# Altium project AudioUFO.PrjPcb
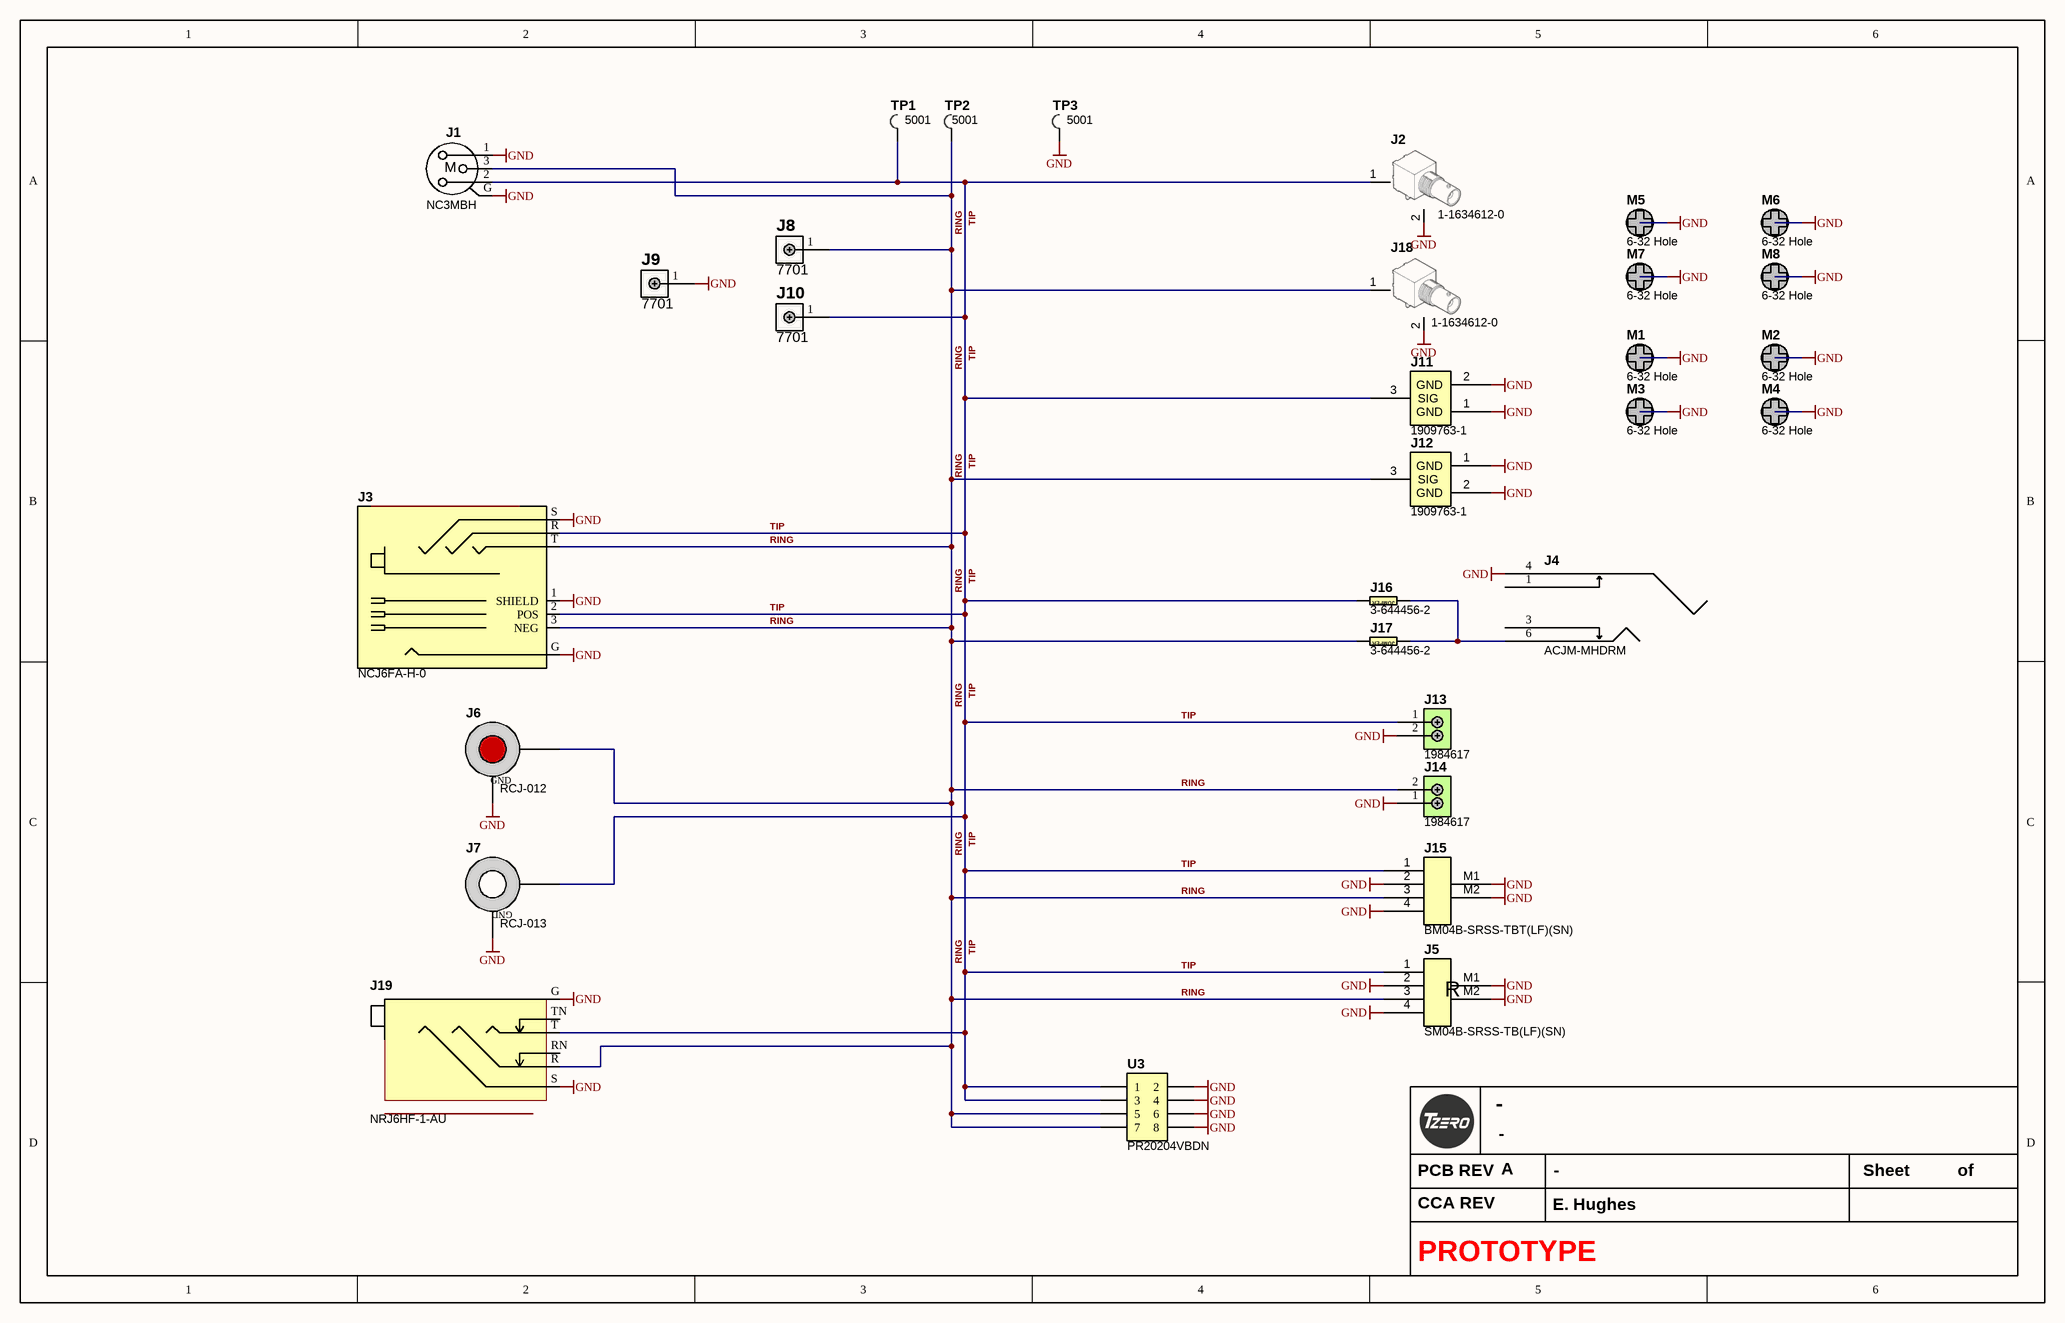
[diagram p0: AudioUFO.SchDoc]
PROJECT_TITLE_LINE_2: -; PROJECT_TITLE_LINE_1: -; PROJECT_STATUS: PROTOTYPE; PROJECT_SHORT_TITLE: AUDIO_UFO; PROJECT_ENGINEER: E. Hughes; PROJECT_BASE_PART_NUMBER: -; PCB_VERSION: A; PCB_SOLDER_MASK_COLOR_TOP: GREEN; PCB_SOLDER_MASK_COLOR_BOTTOM: GREEN; PCB_SILKSCREEN_COLOR_TOP: WHITE; PCB_SILKSCREEN_COLOR_BOTTOM: WHITE; PCB_PRINTOUT_SCALE: 1:1; PCB_PART_NUMBER: AUDIO_UFO; PCB_MIN_TRACE_WIDTH: 6mil; PCB_MIN_TRACE_SPACE: 6mil; PCB_MIN_DRILL: 12mil; PCB_MATERIAL: FR4; PCB_LAYERS: 2; PCB_FINISH_PLATING: LEAD FREE HASL; PCB_FINISHED_THICKNESS: 62.5mil; PCB_DRC_DATE: X; PCB_DIMENSION_Y: X; PCB_DIMENSION_X: X; PCB_COPPER_WEIGHT_OUTER: 1 oz; PCB_COPPER_WEIGHT_INNER: 1oz; BOM_NOTES_LINE_4: -; BOM_NOTES_LINE_3: -; BOM_NOTES_LINE_2: -; BOM_NOTES_LINE_1: -; APPROVAL_REVIEWED_DATE: -; APPROVAL_REVIEWED: -; APPROVAL_ENGINEER_DATE: -; APPROVAL_ENGINEER: -; APPROVAL_DRAWN_DATE: -; APPROVAL_DRAWN: -; APPROVAL_CHECKED_DATE: -; APPROVAL_APPROVED_2_DATE: -; APPROVAL_APPROVED_2: -; APPROVAL_APPROVED_1_DATE: -; APPROVAL_APPROVED_1: -
1 sheet, 31 parts. Net scope: global (net labels, ports and power ports of the same name join across sheets).
Board file: AudioUFO.PcbDoc

## Sheet AudioUFO.SchDoc
size B; Organization: Altium Limited; Address1: 3 Minna Close; Address2: Belrose; Address3: NSW 2085; Address4: Australia; PAGE_TITLE: -

### Parts
J1  NC3MBH  [NC3MBH]
J2  1-1634612-0  [1-1634612-0]
J3  NCJ6FA-H-0  [NEUTRIK_NCJ6FA-H-0]
J4  ACJM-MHDRM  [ACJS-MHDR]
J5  SM04B-SRSS-TB(LF)(SN)  [SM04B-SRSS-TB(LF)(SN)]
J6  RCJ-012  [RCJ-014]
J7  RCJ-013  [RCJ-014]
J8  7701  [7701]
J9  7701  [7701]
J10  7701  [7701]
J11  1909763-1  [1909763-1]
J12  1909763-1  [1909763-1]
J13  1984617  [1984617]
J14  1984617  [1984617]
J15  BM04B-SRSS-TBT(LF)(SN)  [BM04B-SRSS-TBT(LF)(SN)]
J16  3-644456-2  [3-644456-2]
J17  3-644456-2  [3-644456-2]
J18  1-1634612-0  [1-1634612-0]
J19  NRJ6HF-1-AU  [NEUTRIK_NRJ6HF-1]
M1  6-32 Hole  [6-32 X 0]
M2  6-32 Hole  [6-32 X 0]
M3  6-32 Hole  [6-32 X 0]
M4  6-32 Hole  [6-32 X 0]
M5  6-32 Hole  [6-32 X 0]
M6  6-32 Hole  [6-32 X 0]
M7  6-32 Hole  [6-32 X 0]
M8  6-32 Hole  [6-32 X 0]
TP1  5001  [5001]
TP2  5001  [5001]
TP3  5001  [5001]
U3  PR20204VBDN  [HEADER 2x4 .100"]

### Nets
GND: J1.1 J1.G J2.2 J3.1(SHIELD) J3.G J3.S J4.4 J5.2 J5.4 J5.M1 J5.M2 J6.1 J7.1 J9.1 J11.1(GND) J11.2(GND) J12.1(GND) J12.2(GND) J13.2 J14.1 J15.2 J15.4 J15.M1 J15.M2 J18.2 J19.G J19.S M1.1 M2.1 M3.1 M4.1 M5.1 M6.1 M7.1 M8.1 TP3.1 U3.2 U3.4 U3.6 U3.8
RING: J1.3 J3.3(NEG) J3.T J5.3 J6.2(Signal) J8.1 J12.3(SIG) J14.2 J15.3 J17.2 J18.1 J19.R TP2.1 U3.5 U3.7
TIP: J1.2 J2.1 J3.2(POS) J3.R J5.1 J7.2(Signal) J10.1 J11.3(SIG) J13.1 J15.1 J16.2 J19.T TP1.1 U3.1 U3.3
NetJ4_6: J4.6 J16.1 J17.1

Not connected (* = marked no-connect by the designer): J4 1 3; J19 RN TN

### Notes on the sheet
- PCB REV
- Sheet
- of
- CCA REV
- (in symbol 3-644456-2) JUMPER
- (in symbol NC3MBH) M
- (in symbol RCJ-012) GND
- (in symbol RCJ-013) GND
- (in symbol SM04B-SRSS-TB(LF)(SN)) R

### Library data of the parts
J1 = NC3MBH: XLR 3-Pin Male Right Angle; Manufacturer Part Number: NC3MBH-1; MF: NEUTRIK; >NAME: X2; MPN: NC3MBH; OC_FARNELL: unknown; OC_NEWARK: 91F3470; Supplier 1: Newark; Manufacturer: NEUTRIK; Stock 1: 0; Pricing 1: 100=3.06, 300=2.8, 500=2.6, 1000=2.45 (USD); Supplier Part Number 1: 10X8735; Value: NC3MBH
J2 J18 = 1-1634612-0: TE CONNECTIVITY / GREENPAR         1-1634612-0            RF / Coaxial Connector, BNC Coaxial, Right Angle Jack, Solder, 50 ohm, Brass; Plating: Nickel; Dielectric Material: Polyethylene; Frequency: 4GHz; Gender: Female; Polarity: Normal; Insulation Resistance: 5GR; Value: 1-1634612-0; Supplier 1: Digi-Key; Supplier Part Number 1: A97555-ND; Manufacturer: TE Connectivity; Manufacturer Part Number: 1-1634612-0; Stock 1: 5894; Pricing 1: 1=1.62, 10=1.47, 25=1.38, 50=1.32, 100=1.26, 250=1.14, 500=1.05, 1000=0.9 (USD); Mount: Panel; Contact Material: Brass; Contact Plating: Gold; Colour: Black; Body Plating: Nickel; Insulation Material: Polyethylene; Housing Material: Polyester; Min Operating Temperature: -55°C; Max Operating Temperature: 85°C; Termination: Solder; Orientation: Right Angle; Package Quantity: 100; Fastening Type: Bayonet; Max Frequency: 4GHz; Wire/Cable Type: Coaxial; Length: 34.9mm; Depth: 14.7mm; Radiation Hardening: No; REACH SVHC: Unknown; ELV: Compliant; ComponentLink1URL: https://datasheet.ciiva.com/1116/1663556-1116594.pdf; ComponentLink1Description: https://datasheet.ciiva.com/1116/1663556-1116594.pdf; ComponentLink2URL: https://datasheet.ciiva.com/1115/1729824-1115699.pdf; ComponentLink2Description: https://datasheet.ciiva.com/1115/1729824-1115699.pdf; ComponentLink3URL: https://datasheet.ciiva.com/642/eng-cd-1634612-e-642773.pdf; ComponentLink3Description: https://datasheet.ciiva.com/642/eng-cd-1634612-e-642773.pdf; ComponentLink4URL: https://datasheet.ciiva.com/30076/eng-ds-6-1773448-5-zdc-rf-coax-50-75-ohm-1007-30076757.pdf; ComponentLink4Description: https://datasheet.ciiva.com/30076/eng-ds-6-1773448-5-zdc-rf-coax-50-75-ohm-1007-30076757.pdf; ComponentLink5URL: https://datasheet.ciiva.com/16547/eng-ds-6-1773448-5-zdc-rf-coax-50-75-ohm-1007-16547606.pdf; ComponentLink5Description: https://datasheet.ciiva.com/16547/eng-ds-6-1773448-5-zdc-rf-coax-50-75-ohm-1007-16547606.pdf; ComponentLink6URL: https://datasheet.ciiva.com/3133/eng-ds-6-1773448-5-zdc-rf-coax-50-75-ohm-1007-3133498.pdf; ComponentLink6Description: https://datasheet.ciiva.com/3133/eng-ds-6-1773448-5-zdc-rf-coax-50-75-ohm-1007-3133498.pdf; ComponentLink7URL: https://datasheet.ciiva.com/11762/0900766b806d6b45-11762972.pdf; ComponentLink7Description: https://datasheet.ciiva.com/11762/0900766b806d6b45-11762972.pdf
J3 = NCJ6FA-H-0: XLR Connectors A SERIES COMBO;3POLE FEM;NOLATCH;RET SPRG; Manufacturer: Neutrik; CategorySort: 800; Current Rating: 3 A; Gender: Female; Voltage: 50 V; Number of Positions / Contacts: 3; Value: NCJ6FA-H-0; Sort Value: *; Category: Connectors; Supplier 1: Mouser; Supplier Part Number 1: 568-NCJ6FA-H-0; Manufacturer Part Number: NCJ6FA-H-0; RoHS: RoHS Compliant; Stock 1: 0; Pricing 1: 1=2.18, 10=2.11, 25=1.98, 50=1.93, 100=1.80, 200=1.76, 500=1.68, 1000=1.62, 2000=1.51 (USD); Contact Plating: Gold; Orientation: Horizontal; Termination Style: Solder; Contact Material: Bronze; Mounting Style: PCB; Product Category: XLR Panel Mount Connectors; Product Type: Connectors; Standard: Standard XLR; Standard Pack Qty: 10; RoHS - Mouser: Y; Minimum Order Quantity: 1; Reeling: False; ComponentLink1URL: http://www.neutrik.us/en-us/plugs-jacks/jacks/combo-a-series/ncj6fa-h-0; ComponentLink1Description: http://www.neutrik.us/en-us/plugs-jacks/jacks/combo-a-series/ncj6fa-h-0
J4 = ACJM-MHDRM: Phone Connectors 1/4"HOR Snap-fit CHASSIS CONN; Manufacturer: Amphenol Audio; Gender: Female; Number of Positions / Contacts: 1; Switch Configuration: Switched; Supplier 1: Mouser; Manufacturer Part Number: ACJM-MHDRM; Category: Phone Connectors; Stock 1: 9; Pricing 1: 1=1.77, 10=1.66, 50=1.53, 100=1.33 (AUD); Color: Black; Orientation: Horizontal; Series: M Series; Termination Style: Solder; Mounting Style: PCB; Standard: 1/4 in; Minimum Order Quantity: 1; Reeling: False; ComponentLink1URL: http://www.amphenolaudio.com/catalogue/Amphenol_Phone_Plugs_Jacks.pdf; ComponentLink1Description: http://www.amphenolaudio.com/catalogue/Amphenol_Phone_Plugs_Jacks.pdf; Supplier Part Number 1: 523-ACJM-MHDRM; Value: ACJM-MHDRM
J5 = SM04B-SRSS-TB(LF)(SN): Conn Shrouded Header HDR 4 POS 1mm Solder RA SMD T/R; Manufacturer: JST; Number of Positions: 4; Connector Type: Male Pin; Contact Resistance: 40mR; Max Current Rating: 1A; Max Voltage Rating (AC): 50V; Pitch: 0.039inch; Value: SM04B-SRSS-TB(LF)(SN); Supplier 1: Digi-Key; Manufacturer Part Number: SM04B-SRSS-TB(LF)(SN); Stock 1: 43886; Pricing 1: 1=0.61, 10=0.569, 100=0.436, 500=0.37914, 1000=0.31279 (USD); Mount: Surface Mount; Contact Material: Copper Alloy; Contact Plating: Copper,Tin; Colour: Natural; Housing Colour: Beige; Housing Material: Polyamide; Min Operating Temperature: -25°C; Max Operating Temperature: 85°C; Number of Rows: 1; Termination: Solder; Packaging: Tape and Reel; Orientation: Right Angle; Number of Contacts: 4; Max Voltage Rating (DC): 50V; Length: 6mm; Depth: 4.95mm; Lead Free: Lead Free; ComponentLink1URL: https://datasheet.ciiva.com/26894/getdatasheetpartid-499363-26894945.pdf; ComponentLink1Description: https://datasheet.ciiva.com/26894/getdatasheetpartid-499363-26894945.pdf; ComponentLink2URL: https://datasheet.ciiva.com/26894/getdatasheetpartid-640736-26894676.pdf; ComponentLink2Description: https://datasheet.ciiva.com/26894/getdatasheetpartid-640736-26894676.pdf; ComponentLink3URL: https://datasheet.ciiva.com/16487/jstsm04b-srss-tb-lf-sn-16487222.pdf; ComponentLink3Description: https://datasheet.ciiva.com/16487/jstsm04b-srss-tb-lf-sn-16487222.pdf; Supplier Part Number 1: 455-1804-1-ND
J6 = RCJ-012: CONN RCA JACK METAL R/A YEL PCB; Manufacturer: CUI Inc; Connector Type: Phono (RCA) Jack; Gender: Female; Signal Lines: Mono; Plug/Mating Plug Diameter: 3.20mm ID, 9.00mm OD (RCA); Number of Positions/Contacts: 2 Conductors, 2 Contacts; Internal Switch(s): Does Not Contain Switch; Shielding: Unshielded; Color - Contact: Red; Manufacturer Part Number: RCJ-012; RoHS: RoHS Compliant; Category: Connectors, Interconnects; Stock 1: 17644; Pricing 1: 1=0.96, 10=0.746, 100=0.5693, 500=0.4554, 1000=0.4048, 2500=0.33649 (USD); Mounting Type: Through Hole, Right Angle; Termination: Solder; Features: Board Lock; Contact Material: Brass; Contact Material - Plating: Tin; Housing Material: Steel; Housing Color: Silver; Operating Temperature: -20°C ~ 85°C; Voltage - Rated: -; Current Rating: -; Packaging: Bulk; ComponentLink1URL: http://products.cui.com/GetSpecForDigiKey.aspx?MFGNum=RCJ-014; ComponentLink1Description: http://products.cui.com/GetSpecForDigiKey.aspx?MFGNum=RCJ-014; Value: RCJ-012; Supplier 1: Mouser; Supplier Part Number 1: 490-RCJ-012
J7 = RCJ-013: CONN RCA JACK METAL R/A WHITE PCB; Manufacturer: CUI Inc; Connector Type: Phono (RCA) Jack; Gender: Female; Signal Lines: Mono; Plug/Mating Plug Diameter: 3.20mm ID, 9.00mm OD (RCA); Number of Positions/Contacts: 2 Conductors, 2 Contacts; Internal Switch(s): Does Not Contain Switch; Shielding: Unshielded; Manufacturer Part Number: RCJ-013; RoHS: RoHS Compliant; Category: Connectors, Interconnects; Stock 1: 17644; Pricing 1: 1=0.96, 10=0.746, 100=0.5693, 500=0.4554, 1000=0.4048, 2500=0.33649 (USD); Mounting Type: Through Hole, Right Angle; Termination: Solder; Features: Board Lock; Color - Contact: White; Contact Material: Brass; Contact Material - Plating: Tin; Housing Material: Steel; Housing Color: Silver; Operating Temperature: -20°C ~ 85°C; Voltage - Rated: -; Current Rating: -; Packaging: Bulk; ComponentLink1URL: http://products.cui.com/GetSpecForDigiKey.aspx?MFGNum=RCJ-014; ComponentLink1Description: http://products.cui.com/GetSpecForDigiKey.aspx?MFGNum=RCJ-014; Value: RCJ-013; Supplier 1: Digi-Key; Supplier Part Number 1: CP-1402-ND
J8-J10 = 7701: TERM W/ASSEMBLD SCREW VERT PCMNT; Manufacturer: Keystone Electronics; Screw Size: 6-32; Current Rating: 15A; Number of Legs: 4; Screw Material: Brass; Screw Finish: Nickel; Supplier 1: Digi-Key; Supplier Part Number 1: 7701K-ND; Manufacturer Part Number: 7701; RoHS: RoHS Compliant; Category: Connectors, Interconnects; Stock 1: 77817; Pricing 1: 1=0.49, 10=0.462, 50=0.449, 100=0.354, 250=0.32324, 500=0.30784, 1000=0.256, 2500=0.23088, 5000=0.22318 (USD); Terminal Type: Screw Terminal, Power Tap; Termination: Solder; Mounting Type: Through Hole; Features: -; Contact Finish: Tin; Contact Material: Brass; Material - Insulation: -; ComponentLink1URL: http://www.keyelco.com/product-pdf.cfm?p=1081; ComponentLink1Description: http://www.keyelco.com/product-pdf.cfm?p=1081; Value: 7701
J11 J12 = 1909763-1: CONN UMCC JACK STR 50OHM SMD; Manufacturer: TE Connectivity AMP Connectors; Connector Style: Ultra Miniature Coaxial; Connector Type: Jack, Male Pin; Contact Termination: Solder; Body Material: Copper Alloy; Body Finish: Gold; Dielectric Material: Liquid Crystal Polymer (LCP); Voltage Rating: 60V; Mating Cycles: 30; Insertion Loss: 0.24dB; Value: 1909763-1; Supplier 1: Digi-Key; Supplier Part Number 1: A118077CT-ND; Manufacturer Part Number: 1909763-1; RoHS: RoHS Compliant; Category: Connectors, Interconnects; Stock 1: 75031; Pricing 1: 1=0.49, 10=0.462, 25=0.416, 50=0.3696, 100=0.3542, 250=0.3234, 500=0.308, 1000=0.2541, 2500=0.231 (USD); Packaging: Cut Tape (CT); Part Status: Active; Shield Termination: Solder; Impedance: 50 Ohm; Mounting Type: Surface Mount; Mounting Feature: -; Cable Group: -; Fastening Type: Snap-On; Features: -; Housing Color: Ivory; Ingress Protection: -; Includes: -; Center Contact Plating: Gold; Operating Temperature: -40°C ~ 90°C; Center Contact Material: Copper Alloy; ComponentLink1URL: http://www.te.com/commerce/DocumentDelivery/DDEController?Action=srchrtrv&DocNm=1909763&DocType=Customer+Drawing&DocLang=English; ComponentLink1Description: http://www.te.com/commerce/DocumentDelivery/DDEController?Action=srchrtrv&DocNm=1909763&DocType=Customer+Drawing&DocLang=English
J13 J14 = 1984617: CONN TERM BLOCK T/H 2POS 3.5MM; Manufacturer: Phoenix Contact; Number of Levels: 1; Positions Per Level: 2; Pitch: 0.138" (3.50mm); Mating Orientation: Horizontal with Board; Current: 10A; Voltage: 300V; Wire Gauge: 16-26 AWG; Wire Termination: Screw - Rising Cage Clamp; Torque - Screw: 0.22-0.25 Nm (1.9-2.2 Lb-In); Screw Thread: M2; Supplier 1: Digi-Key; Supplier Part Number 1: 277-1721-ND; Manufacturer Part Number: 1984617; RoHS: RoHS Compliant; Category: Connectors, Interconnects; Stock 1: 10915; Pricing 1: 1=0.34, 10=0.322, 50=0.308, 100=0.2996, 250=0.28, 500=0.2576, 1000=0.238 (USD); Mounting Type: Through Hole; Features: Interlocking (Side); Color: Green; Packaging: Bulk; Operating Temperature: -; Housing Material: Polyamide (PA), Nylon; Contact Material - Plating: -; Clamp Material - Plating: -; Screw Material - Plating: -; ComponentLink1URL: http://media.digikey.com/pdf/Data%20Sheets/Phoenix%20Contact%20PDFs/1984617.pdf; ComponentLink1Description: http://media.digikey.com/pdf/Data%20Sheets/Phoenix%20Contact%20PDFs/1984617.pdf; Value: 1984617
J15 = BM04B-SRSS-TBT(LF)(SN): 1.0mm Pitch, Ultra-Compact, Low Profile Design, Interchangeable Shrouded Header; Manufacturer: JST; Number of Positions: 4; Connector Type: Male Pin; Pitch: 0.039inch; Value: BM04B-SRSS-TBT(LF)(SN); Supplier 1: Digi-Key; Supplier Part Number 1: 455-2874-1-ND; Manufacturer Part Number: BM04B-SRSS-TBT(LF)(SN); Stock 1: 798; Pricing 1: 1=0.81, 10=0.715, 100=0.617, 500=0.50486 (USD); Mount: Surface Mount; Colour: Natural; Contact Plating: Tin; Number of Rows: 1; Packaging: Tape and Reel; Termination: Solder; Package Quantity: 1; Lead Free: Lead Free; ComponentLink1URL: https://datasheet.ciiva.com/16210/esr-16210536.pdf; ComponentLink1Description: https://datasheet.ciiva.com/16210/esr-16210536.pdf
J16 J17 = 3-644456-2: CONN HEADER VERT 2POS .100 TIN; Manufacturer: TE Connectivity; Connector Type: Header, Unshrouded; Number of Positions: 2; Number of Positions Loaded: All; Pitch: 0.100" (2.54mm); Supplier 1: Digi-Key; Supplier Part Number 1: A31112-ND; Manufacturer Part Number: 3-644456-2; RoHS: RoHS Compliant; Category: Connectors, Interconnects; Stock 1: 15628; Pricing 1: 1=0.21, 10=0.196, 25=0.1676, 50=0.1466, 100=0.1362, 250=0.12044, 500=0.11522, 1000=0.09427, 2500=0.08641 (USD); Contact Type: Male Pin; Number of Rows: 1; Row Spacing: -; Contact Mating Length: 0.295" (7.49mm); Mounting Type: Through Hole; Termination: Solder; Fastening Type: -; Features: -; Contact Finish: Tin; Contact Finish Thickness: 150µin (3.81µm); Color: Natural; Packaging: Bulk; ComponentLink1URL: http://documents.tycoelectronics.com/commerce/DocumentDelivery/DDEController?Action=srchrtrv&DocNm=644456&DocType=CD&DocLang=EN; ComponentLink1Description: http://documents.tycoelectronics.com/commerce/DocumentDelivery/DDEController?Action=srchrtrv&DocNm=644456&DocType=CD&DocLang=EN; Value: 3-644456-2
J19 = NRJ6HF-1-AU: Phone Connectors 1/4" JACK STEREO SW SLIM-FULL THREAD NSE; Manufacturer: Neutrik; CategorySort: 800; Contact Rating: 3 A; Gender: Female; Number of Positions: 3 (TRS, Stereo); Voltage Rating: 50 V; Category: Connectors; Value: NRJ6HF-1-AU; Supplier 1: Mouser; Supplier Part Number 1: 568-NRJ6HF-1-AU; Manufacturer Part Number: NRJ6HF-1-AU; RoHS: RoHS Compliant; Stock 1: 1463; Pricing 1: 1=1.53, 10=1.51, 25=1.40, 50=1.39, 100=1.29, 200=1.18, 500=1.12 (USD); Color: Black; Contact Plating: Gold; Orientation: Horizontal; Series: Slim Jack; Brand: Neutrik; Contact Material: Bronze; Mounting Style: Through Hole; Standard: 1/4 in; Standard Pack Qty: 200; RoHS - Mouser: Y; Minimum Order Quantity: 1; Reeling: False
TP1-TP3 = 5001: KEYSTONE - 5001 - TEST POINT, CONNECTOR, BLACK; Manufacturer: Keystone Electronics; Plating: Silver; Body Material: PBT,Bronze; Number of Ports: 1; Insulation: Insulated; Inside Diameter: 1.27mm; Outside Diameter: 2.54mm; Hole Diameter: 1.6mm; Value: 5001; Supplier 1: Digi-Key; Supplier Part Number 1: 36-5001-ND; Manufacturer Part Number: 5001; RoHS: Yes; Category: Test Probes, Leads and Clips; Stock: 463593; Pricing: 1=0.35000, 10=0.33500, 50=0.24380, 250=0.21032, 1000=0.17140, 2500=0.15296, 5000=0.14340 (USD); Mount: Through Hole,PCB; Color: Black; Contact Material: Bronze; Contact Plating: Silver,Tin; Material: Nylon,Bronze,Silver; Housing Color: Black; Packaging: Bulk; Package Quantity: 100; Termination: Through Hole; Number of Contacts: 1; Orientation: Straight; Diameter: 2.54mm; Length: 7.62mm; Height: 0.3inch; Lead Free: Lead Free; REACH SVHC: No SVHC; Flammability Rating: UL94 V-0; ComponentLink1URL: https://datasheet.ciiva.com/27052/1581986-27052611.pdf?src-supplier=Jameco; ComponentLink1Description: https://datasheet.ciiva.com/27052/1581986-27052611.pdf?src-supplier=Jameco; ComponentLink2URL: https://datasheet.ciiva.com/11836/0900766b8009b7c7-11836045.pdf?src-supplier=RSComponents; ComponentLink2Description: https://datasheet.ciiva.com/11836/0900766b8009b7c7-11836045.pdf?src-supplier=RSComponents; ComponentLink3URL: https://datasheet.ciiva.com/16318/m60-2p60-16318423.pdf?src-supplier=Future+Electronics; ComponentLink3Description: https://datasheet.ciiva.com/16318/m60-2p60-16318423.pdf?src-supplier=Future+Electronics; ComponentLink4URL: https://datasheet.ciiva.com/22631/1703983-22631100.pdf?src-supplier=Element14; ComponentLink4Description: https://datasheet.ciiva.com/22631/1703983-22631100.pdf?src-supplier=Element14
U3 = PR20204VBDN: 2x4 Header .100"; Manufacturer: METZ CONNECT; Value: PR20204VBDN; Supplier 1: Digi-Key; Supplier Part Number 1: 1849-PR20204VBDN-ND; Manufacturer Part Number: PR20204VBDN; RoHS: No; Stock: 3387; Pricing: 1=0.16000, 10=0.15400, 100=0.09510, 500=0.07872, 1000=0.06888, 5000=0.05904, 10000=0.05740 (USD)
M1-M8 = 6-32 Hole: Source: Digikey; Source Part Number: *; Manufacturer: *; Manufacturer Part Number: *; ROHS Certificate: *; Value: *